# Altium project PLC-无线通讯版-显示板-V3.PrjPCB
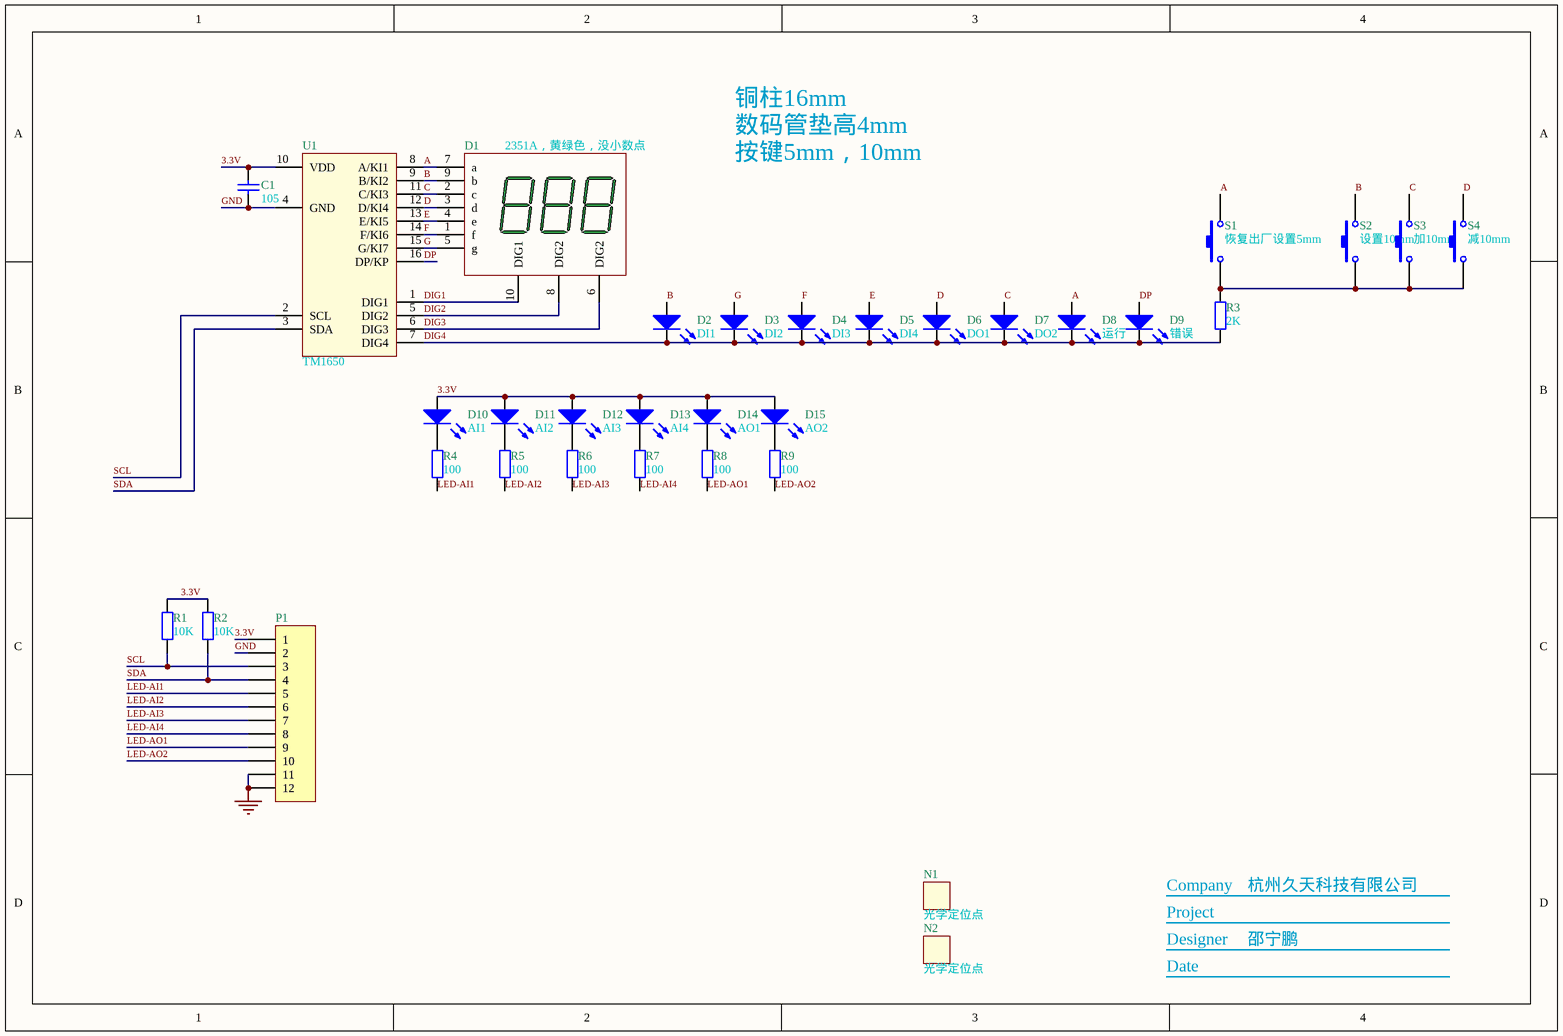
[diagram p0: PLC-无线通讯版-显示板-V3.SchDoc]
1 sheet, 33 parts. Net scope: global (net labels, ports and power ports of the same name join across sheets).
Board file: PLC-无线通讯版-显示板-V3.PcbDoc

## Sheet PLC-无线通讯版-显示板-V3.SchDoc
size A4

### Parts
C1  105  [C-0603]
D1  2351A，黄绿色，没小数点  [3位0.25英寸]
D2  DI1  [LED-0603-GREEN]
D3  DI2  [LED-0603-GREEN]
D4  DI3  [LED-0603-GREEN]
D5  DI4  [LED-0603-GREEN]
D6  DO1  [LED-0603-GREEN]
D7  DO2  [LED-0603-GREEN]
D8  运行  [LED-0603-Blue]
D9  错误  [LED-0603-Red]
D10  AI1  [LED-0603-GREEN]
D11  AI2  [LED-0603-GREEN]
D12  AI3  [LED-0603-GREEN]
D13  AI4  [LED-0603-GREEN]
D14  AO1  [LED-0603-GREEN]
D15  AO2  [LED-0603-GREEN]
N1  光学定位点  [MARK-1mm-3mm]
N2  光学定位点  [MARK-1mm-3mm]
P1  (no value)  [FPC-1.0mm下接翻盖_10P]
R1  10K  [R-0603]
R2  10K  [R-0603]
R3  2K  [R-0603]
R4  100  [R-0603]
R5  100  [R-0603]
R6  100  [R-0603]
R7  100  [R-0603]
R8  100  [R-0603]
R9  100  [R-0603]
S1  恢复出厂设置5mm  [SB-6*6*9.5_贴片]
S2  设置10mm  [SB-6*6*9.5_贴片]
S3  加10mm  [SB-6*6*9.5_贴片]
S4  减10mm  [SB-6*6*9.5_贴片]
U1  TM1650  [SOP-16-M]

### Nets
GND: C1.1 P1.2 P1.11 P1.12 U1.4(GND)
3.3V: C1.2 D10.1(A) D11.1(A) D12.1(A) D13.1(A) D14.1(A) D15.1(A) P1.1 R1.2 R2.2 U1.10(VDD)
A: D1.7(a) D8.1(A) S1.2 U1.8(A/KI1)
B: D1.9(b) D2.1(A) S2.2 U1.9(B/KI2)
C: D1.2(c) D7.1(A) S3.2 U1.11(C/KI3)
D: D1.3(d) D6.1(A) S4.2 U1.12(D/KI4)
DIG1: D1.10(DIG1) U1.1(DIG1)
DIG2: D1.8(DIG2) U1.5(DIG2)
DIG3: D1.6(DIG2) U1.6(DIG3)
DIG4: D2.2(K) D3.2(K) D4.2(K) D5.2(K) D6.2(K) D7.2(K) D8.2(K) D9.2(K) R3.2 U1.7(DIG4)
DP: D9.1(A) U1.16(DP/KP)
E: D1.4(e) D5.1(A) U1.13(E/KI5)
F: D1.1(f) D4.1(A) U1.14(F/KI6)
G: D1.5(g) D3.1(A) U1.15(G/KI7)
LED-AI1: P1.5 R4.2
LED-AI2: P1.6 R5.2
LED-AI3: P1.7 R6.2
LED-AI4: P1.8 R7.2
LED-AO1: P1.9 R8.2
LED-AO2: P1.10 R9.2
SCL: P1.3 R1.1 U1.2(SCL)
SDA: P1.4 R2.1 U1.3(SDA)
NetD10_2: D10.2(K) R4.1
NetD11_2: D11.2(K) R5.1
NetD12_2: D12.2(K) R6.1
NetD13_2: D13.2(K) R7.1
NetD14_2: D14.2(K) R8.1
NetD15_2: D15.2(K) R9.1
NetR3_1: R3.1 S1.1 S2.1 S3.1 S4.1

### Notes on the sheet
- 铜柱16mm
- 数码管垫高4mm
- 按键5mm，10mm
- Project
- Company
- 杭州久天科技有限公司
- Designer
- Date
- 邵宁鹏

### Library data of the parts
C1 = Cap: Capacitor; Published: 8-Jun-2000; LatestRevisionDate: 17-Jul-2002; LatestRevisionNote: Re-released for DXP Platform.; PackageReference: RAD-0.3; Publisher: Altium Limited
D1 = 3位数码管-无点-2351A
D2-D15 = LED-0603-Blue: Published: 8-Jun-2000; LatestRevisionDate: 08-Jul-2005; LatestRevisionNote: Mech Layer 1 removed.; PackageReference: LED-0; Publisher: Altium Limited
N1 N2 = 无引脚
P1 = Header 12: Header, 12-Pin; LatestRevisionDate: 17-Jul-2002; LatestRevisionNote: Re-released for DXP Platform.; Publisher: Altium Limited
R1-R9 = Res2-0603: 0603; Published: 8-Jun-2000; LatestRevisionDate: 17-Jul-2002; LatestRevisionNote: Re-released for DXP Platform.; PackageReference: AXIAL-0.4; Publisher: Altium Limited
S1-S4 = SB-6*6*9: SB-6*6*10; Published: 24-Mar-1999; LatestRevisionDate: 17-Jul-2002; LatestRevisionNote: Re-released for DXP Platform.; PackageReference: SPST-2; Publisher: Altium Limited
U1 = TM1650: 共阴数码管驱动器